# EAGLE design Group_08 (EAGLE 9.6.2)
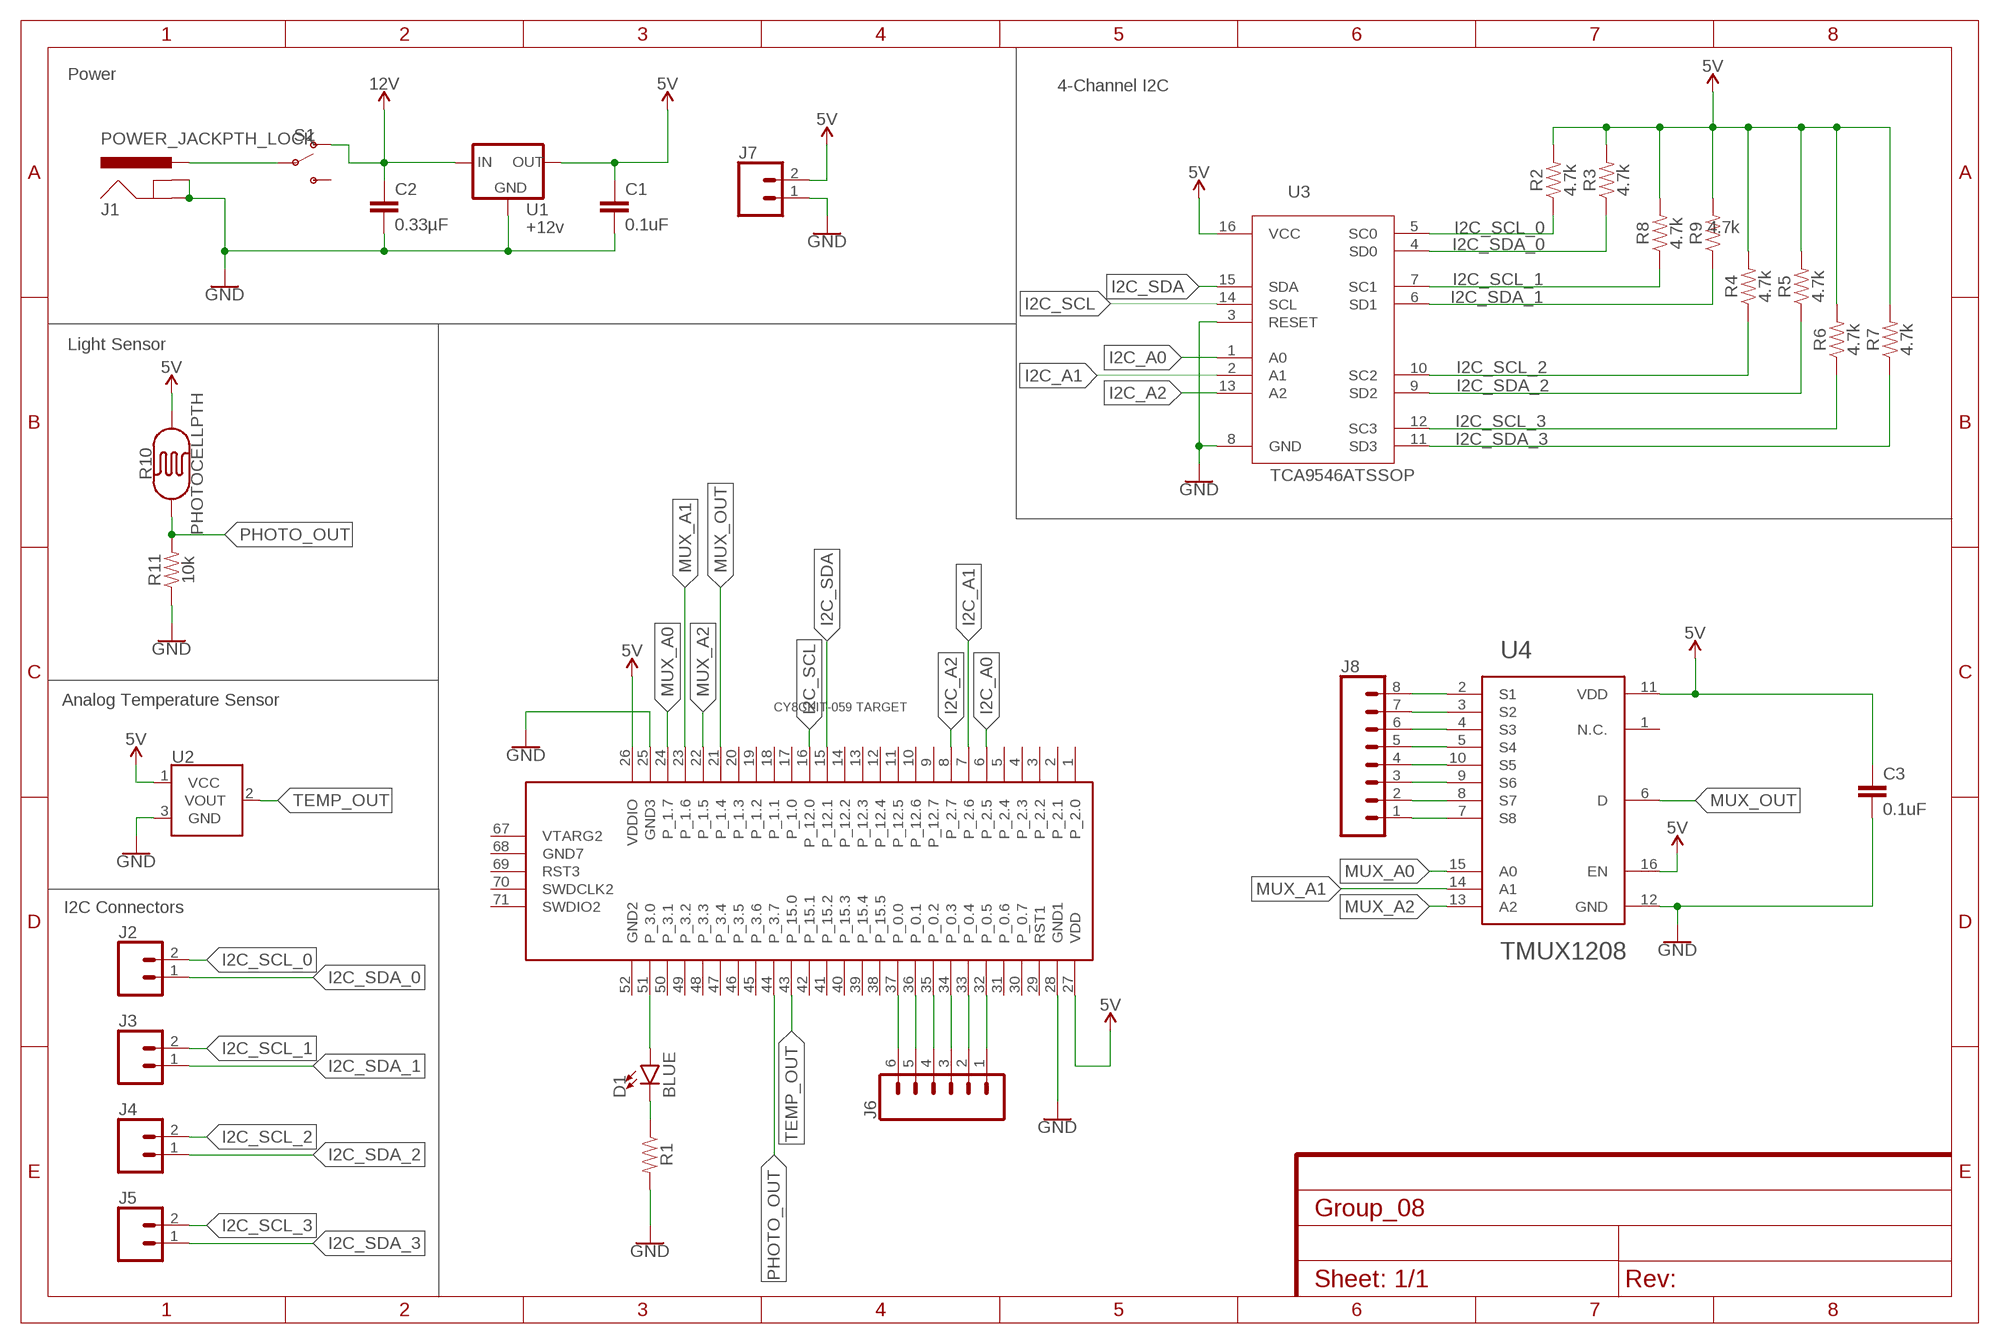
[diagram p0: schematic, sheet 1]

## Parts
C1  0.1uF  0.1UF-KIT-EZ-50V-20%  [CAP-PTH-SMALL-KIT]
C2  0.33µF  0.33UF/330NF-0805-50V-10%  [0805]
C3  0.1uF  0.1UF-KIT-EZ-50V-20%  [CAP-PTH-SMALL-KIT]
CY8CKIT059-TARGET  CY8CKIT-059_TARGET  [CY8CKIT-059_TARGET]
D1  BLUE  LED-BLUE1206  [LED-1206]
J1  POWER_JACKPTH_LOCK  [POWER_JACK_PTH_LOCK]
J2  CONN_02  [1X02]
J3  CONN_02  [1X02]
J4  CONN_02  [1X02]
J5  CONN_02  [1X02]
J6  CONN_06LOCK  [1X06_LOCK]
J7  CONN_02  [1X02]
J8  CONN_08LOCK  [1X08_LOCK]
R1  RESISTORAXIAL-0.3  [AXIAL-0.3]
R2  4.7k  4.7KOHM-0603-1/10W-1%  [0603]
R3  4.7k  4.7KOHM-0603-1/10W-1%  [0603]
R4  4.7k  4.7KOHM-0603-1/10W-1%  [0603]
R5  4.7k  4.7KOHM-0603-1/10W-1%  [0603]
R6  4.7k  4.7KOHM-0603-1/10W-1%  [0603]
R7  4.7k  4.7KOHM-0603-1/10W-1%  [0603]
R8  4.7k  4.7KOHM-0603-1/10W-1%  [0603]
R9  4.7k  4.7KOHM-0603-1/10W-1%  [0603]
R10  PHOTOCELLPTH  [PHOTOCELL]
R11  10k  10KOHM-0603-1/10W-1%  [0603]
S1  SWITCH-SPDT-PTH-11.6X4.0MM  [SWITCH_SPDT_PTH_11.6X4.0MM]
U1  +12v  V_REG_78XX7812  [TO-252]
U2  TMP36GT9  [TO-92]
U3  TCA9546ATSSOP  [TSSOP16]
U4  TMUX1208  [QFN16]

## Nets
5V: C1.1 C3.1 CY8CKIT059-TARGET.26(VDDIO) CY8CKIT059-TARGET.27(VDD) J7.2 R2.2 R3.2 R4.2 R5.2 R6.2 R7.2 R8.2 R9.2 R10.2 U1.2(OUT) U2.1(VCC) U3.16(VCC) U4.11(VDD) U4.16(EN)
12V: C2.1 S1.1(O) U1.1(IN)
GND: C1.2 C2.2 C3.2 CY8CKIT059-TARGET.25(GND3) CY8CKIT059-TARGET.28(GND1) J1.GND J1.GNDBREAK J7.1 R1.P$2 R11.1 U1.3(GND) U2.3(GND) U3.3(RESET) U3.8(GND) U4.12(GND)
I2C_A0: CY8CKIT059-TARGET.6(P_2.5) U3.1(A0)
I2C_A1: CY8CKIT059-TARGET.7(P_2.6) U3.2(A1)
I2C_A2: CY8CKIT059-TARGET.8(P_2.7) U3.13(A2)
I2C_SCL: CY8CKIT059-TARGET.16(P_12.0) U3.14(SCL)
I2C_SCL_0: J2.2 R2.1 U3.5(SC0)
I2C_SCL_1: J3.2 R8.1 U3.7(SC1)
I2C_SCL_2: J4.2 R4.1 U3.10(SC2)
I2C_SCL_3: J5.2 R6.1 U3.12(SC3)
I2C_SDA: CY8CKIT059-TARGET.15(P_12.1) U3.15(SDA)
I2C_SDA_0: J2.1 R3.1 U3.4(SD0)
I2C_SDA_1: J3.1 R9.1 U3.6(SD1)
I2C_SDA_2: J4.1 R5.1 U3.9(SD2)
I2C_SDA_3: J5.1 R7.1 U3.11(SD3)
MUX_A0: CY8CKIT059-TARGET.24(P_1.7) U4.15(A0)
MUX_A1: CY8CKIT059-TARGET.23(P_1.6) U4.14(A1)
MUX_A2: CY8CKIT059-TARGET.22(P_1.5) U4.13(A2)
MUX_OUT: CY8CKIT059-TARGET.21(P_1.4) U4.6(D)
N$2: J1.PWR S1.2(P)
N$10: J8.1 U4.7(S8)
N$11: J8.2 U4.8(S7)
N$12: J8.3 U4.9(S6)
N$13: J8.4 U4.10(S5)
N$14: J8.5 U4.5(S4)
N$16: J8.6 U4.4(S3)
N$17: J8.7 U4.3(S2)
N$18: J8.8 U4.2(S1)
N$19: CY8CKIT059-TARGET.37(P_0.0) J6.6
N$20: CY8CKIT059-TARGET.32(P_0.5) J6.1
N$21: CY8CKIT059-TARGET.33(P_0.4) J6.2
N$22: CY8CKIT059-TARGET.34(P_0.3) J6.3
N$23: CY8CKIT059-TARGET.35(P_0.2) J6.4
N$24: CY8CKIT059-TARGET.36(P_0.1) J6.5
N$25: D1.C R1.P$1
N$26: CY8CKIT059-TARGET.51(P_3.0) D1.A
PHOTO_OUT: CY8CKIT059-TARGET.44(P_3.7) R10.1 R11.2
TEMP_OUT: CY8CKIT059-TARGET.43(P_15.0) U2.2(VOUT)
Unconnected: CY8CKIT059-TARGET.1(P_2.0) CY8CKIT059-TARGET.2(P_2.1) CY8CKIT059-TARGET.3(P_2.2) CY8CKIT059-TARGET.4(P_2.3) CY8CKIT059-TARGET.5(P_2.4) CY8CKIT059-TARGET.9(P_12.7) CY8CKIT059-TARGET.10(P_12.6) CY8CKIT059-TARGET.11(P_12.5) CY8CKIT059-TARGET.12(P_12.4) CY8CKIT059-TARGET.13(P_12.3) CY8CKIT059-TARGET.14(P_12.2) CY8CKIT059-TARGET.17(P_1.0) CY8CKIT059-TARGET.18(P_1.1) CY8CKIT059-TARGET.19(P_1.2) CY8CKIT059-TARGET.20(P_1.3) CY8CKIT059-TARGET.29(RST1) CY8CKIT059-TARGET.30(P_0.7) CY8CKIT059-TARGET.31(P_0.6) CY8CKIT059-TARGET.38(P_15.5) CY8CKIT059-TARGET.39(P_15.4) CY8CKIT059-TARGET.40(P_15.3) CY8CKIT059-TARGET.41(P_15.2) CY8CKIT059-TARGET.42(P_15.1) CY8CKIT059-TARGET.45(P_3.6) CY8CKIT059-TARGET.46(P_3.5) CY8CKIT059-TARGET.47(P_3.4) CY8CKIT059-TARGET.48(P_3.3) CY8CKIT059-TARGET.49(P_3.2) CY8CKIT059-TARGET.50(P_3.1) CY8CKIT059-TARGET.52(GND2) CY8CKIT059-TARGET.67(VTARG2) CY8CKIT059-TARGET.68(GND7) CY8CKIT059-TARGET.69(RST3) CY8CKIT059-TARGET.70(SWDCLK2) CY8CKIT059-TARGET.71(SWDIO2) S1.3(S) U4.1(N.C.)

## Notes on the sheet
- Power
- 4-Channel I2C
- Light Sensor
- Analog Temperature Sensor
- I2C Connectors

## Library data of the parts
C1 C3 = SparkFun-Capacitors:0.1UF: 0.1µF ceramic capacitors A capacitor is a passive two-terminal electrical component used to store electrical energy temporarily in an electric field.; PROD_ID: CAP-08370
C2 = SparkFun-Capacitors:0.33UF/330NF: 0.33µF/330nF ceramic capacitors A capacitor is a passive two-terminal electrical component used to store electrical energy temporarily in an electric field.; PROD_ID: CAP-08469
CY8CKIT059-TARGET = CY8KIT-059:CY8CKIT-059_TARGET: CY8CKIT-059 Target This device exposes the pins of the target section of the CY8CKIT-059, including the programming section, that must be connected to the KitProg in order to program the target micro-controller.
D1 = SparkFun-LED:LED-BLUE: Blue SMD LED Used in manufacturing of various products at SparkFun Packages: 0603 - SMD 0603 package [Product Link] <http://www.digikey.com/product-detail/en/SMLE12BC7TT86/511-1589-2-ND/1641808> 1206 - SMD1206 package [Product Link] <http://www.digikey.com/product-detail/en/lite-on-inc/LTST-C150TBKT/160-1643-1-ND/573584> SparkFun Products: ESP8266 Thing-Dev Board <https://www.sparkfun.com/products/13711> RedBoard <https://www.sparkfun.com/products/12757>; PROD_ID: DIO-09911
J1 = SparkFun-Connectors:POWER_JACK: Power Jack Connector This is the standard 5.5mm barrel jack for power. The PTH is the most common, proven, reliable, footprint. The Slot footprint only works if the mill layer is transmitted to the PCB fab house so be warned. Here are the connectors we sell at SparkFun: DC Barrel Power Jack/Connector <https://www.sparkfun.com/products/119> (PRT-00119) DC Barrel Power Jack/Connector (SMD) <https://www.sparkfun.com/products/12748> (PRT-12748) DC Barrel Jack Adapter - Breadboard Compatible <https://www.sparkfun.com/products/10811> (PRT-10811) It is used on this SparkFun product (and many, many others): SparkFun RedBoard - Programmed with Arduino <https://www.sparkfun.com/products/12757> (DEV-12757) Also, if you need a mating power supply or connector, please check these out: Wall Adapter Power Supply - 9VDC 650mA <https://www.sparkfun.com/products/298> (TOL-00298) DC Barrel Jack Adapter - Male <https://www.sparkfun.com/products/10287> (PRT-10287); PROD_ID: CONN-08197; SF_ID: PRT-00119
J2-J5 J7 = SparkFun-Connectors:CONN_02: Multi connection point. Often used as Generic Header-pin footprint for 0.1 inch spaced/style header connections On any of the 0.1 inch spaced packages, you can populate with these: Break Away Headers - Straight <https://www.sparkfun.com/products/116> (PRT-00116) Break Away Male Headers - Right Angle <https://www.sparkfun.com/products/553> (PRT-00553) Female Headers <https://www.sparkfun.com/products/115> (PRT-00115) Break Away Headers - Machine Pin <https://www.sparkfun.com/products/117> (PRT-00117) Break Away Female Headers - Swiss Machine Pin <https://www.sparkfun.com/products/743> (PRT-00743) For SCREWTERMINALS and SPRING TERMINALS visit here: Screw Terimnals on SparkFun.com <https://www.sparkfun.com/search/results?term=Screw+Terminals> (5mm/3.5mm/2.54mm spacing) This device is also useful as a general connection point to wire up your design to another part of your project. Our various solder wires solder well into these plated through hole pads. Hook-Up Wire - Assortment (Stranded, 22 AWG) <https://www.sparkfun.com/products/11375> (PRT-11375) Hook-Up Wire - Assortment (Solid Core, 22 AWG) <https://www.sparkfun.com/products/11367> (PRT-11367) View the entire wire category on our website here <https://www.sparkfun.com/categories/141> Special notes: Molex polarized connector foot print use with: PRT-08233 with associated crimp pins and housings. 2.54_SCREWTERM for use with PRT-10571. 3.5mm Screw Terminal footprints for PRT-08084 5mm Screw Terminal footprints for use with PRT-08432
J6 = SparkFun-Connectors:CONN_06: Multi connection point. Often used as Generic Header-pin footprint for 0.1 inch spaced/style header connections On any of the 0.1 inch spaced packages, you can populate with these: Break Away Headers - Straight <https://www.sparkfun.com/products/116> (PRT-00116) Break Away Male Headers - Right Angle <https://www.sparkfun.com/products/553> (PRT-00553) Female Headers <https://www.sparkfun.com/products/115> (PRT-00115) Break Away Headers - Machine Pin <https://www.sparkfun.com/products/117> (PRT-00117) Break Away Female Headers - Swiss Machine Pin <https://www.sparkfun.com/products/743> (PRT-00743) Arduino Stackable Header - 6 Pin <https://www.sparkfun.com/products/9280> (PRT-09280) For SCREWTERMINALS and SPRING TERMINALS visit here: Screw Terimnals on SparkFun.com <https://www.sparkfun.com/search/results?term=Screw+Terminals> (5mm/3.5mm/2.54mm spacing) This device is also useful as a general connection point to wire up your design to another part of your project. Our various solder wires solder well into these plated through hole pads. Hook-Up Wire - Assortment (Stranded, 22 AWG) <https://www.sparkfun.com/products/11375> (PRT-11375) Hook-Up Wire - Assortment (Solid Core, 22 AWG) <https://www.sparkfun.com/products/11367> (PRT-11367) View the entire wire category on our website here <https://www.sparkfun.com/categories/141>
J8 = SparkFun-Connectors:CONN_08: Multi connection point. Often used as Generic Header-pin footprint for 0.1 inch spaced/style header connections On any of the 0.1 inch spaced packages, you can populate with these: Break Away Headers - Straight <https://www.sparkfun.com/products/116> (PRT-00116) Break Away Male Headers - Right Angle <https://www.sparkfun.com/products/553> (PRT-00553) Female Headers <https://www.sparkfun.com/products/115> (PRT-00115) Break Away Headers - Machine Pin <https://www.sparkfun.com/products/117> (PRT-00117) Break Away Female Headers - Swiss Machine Pin <https://www.sparkfun.com/products/743> (PRT-00743) Arduino Stackable Header - 8 Pin <https://www.sparkfun.com/products/9279> (PRT-09279) For SCREWTERMINALS and SPRING TERMINALS visit here: Screw Terimnals on SparkFun.com <https://www.sparkfun.com/search/results?term=Screw+Terminals> (5mm/3.5mm/2.54mm spacing) This device is also useful as a general connection point to wire up your design to another part of your project. Our various solder wires solder well into these plated through hole pads. Hook-Up Wire - Assortment (Stranded, 22 AWG) <https://www.sparkfun.com/products/11375> (PRT-11375) Hook-Up Wire - Assortment (Solid Core, 22 AWG) <https://www.sparkfun.com/products/11367> (PRT-11367) View the entire wire category on our website here <https://www.sparkfun.com/categories/141> Special notes: Molex polarized connector foot print use with SKU : PRT-08231 with associated crimp pins and housings. 1MM SMD Version SKU: PRT-10208 NOTES ON THE VARIANTS LOCK and LOCK_LONGPADS... This footprint was designed to help hold the alignment of a through-hole component (i.e. 6-pin header) while soldering it into place. You may notice that each hole has been shifted either up or down by 0.005 of an inch from it's more standard position (which is a perfectly straight line). This slight alteration caused the pins (the squares in the middle) to touch the edges of the holes. Because they are alternating, it causes a "brace" to hold the component in place. 0.005 has proven to be the perfect amount of "off-center" position when using our standard breakaway headers. Although looks a little odd when you look at the bare footprint, once you have a header in there, the alteration is very hard to notice. Also,if you push a header all the way into place, it is covered up entirely on the bottom side.
R1 = SparkFun-Resistors:RESISTOR: Generic Resistor Package
R2-R9 = SparkFun-Resistors:4.7KOHM: 4.7kΩ resistor A resistor is a passive two-terminal electrical component that implements electrical resistance as a circuit element. Resistors act to reduce current flow, and, at the same time, act to lower voltage levels within circuits. - Wikipedia; PROD_ID: RES-07857
R10 = SparkFun-Sensors:PHOTOCELL: Photocell (Photodetector, Photo Resistor, CdS) This is a very small light sensor. A photocell changes (also called a photodetector, photo resistor, CdS or photoconductive cell) resistance depending on the amount of light it is exposed to. These little sensors make great ambient light triggers (when light in the room turns on, do something). Datasheet <http://cdn.sparkfun.com/datasheets/Sensors/LightImaging/SEN-09088.pdf> SparkFun Products Mini Photocell <https://www.sparkfun.com/products/9088> (SEN-09088); PROD_ID: COMP-09129; SF_ID: SEN-09088
R11 = SparkFun-Resistors:10KOHM: 10kΩ resistor A resistor is a passive two-terminal electrical component that implements electrical resistance as a circuit element. Resistors act to reduce current flow, and, at the same time, act to lower voltage levels within circuits. - Wikipedia; PROD_ID: RES-00824
S1 = SparkFun-Switches:SWITCH-SPDT: Single Pole, Double Throw (SPDT) Switch Single-pole, double-throw (SPDT) switch. Variant Overview SMD-AYZ0202 Surface Mount DPDT Switch <https://www.sparkfun.com/products/597> (COM-00597) Used on e.g. LilyPad Arduino USB - ATmega32U4 Board <https://www.sparkfun.com/products/12049> PTH-11.6X4.0MM SPDT Mini Power Switch <https://www.sparkfun.com/products/102> (COM-00102) Used on e.g. SparkFun Simon Says - Through-Hole Soldering Kit <https://www.sparkfun.com/products/10547> (KIT-10547) PTH-11.6X4.0MM-KIT KIT version of SPDT Mini Power Switch - Simplifies soldering by removing tStop of switch pins - only one side can be soldered. PTH-11.6X4.0MM-LOCK LOCK version of SPDT Mini Power Switch - Offset pins hold switch in place for easier soldering. SMD-RIGHT-ANGLE Surface Mount Right Angle Switch <https://www.sparkfun.com/products/10860> (COM-10860) Used on e.g. SparkFun ESP8266 Thing <https://www.sparkfun.com/products/13231>; PROD_ID: SWCH-08261; SF_SKU: COM-00102
U1 = SparkFun-IC-Power:V_REG_78XX: Voltage Regulator Standard 78xx regulator. IGO (Input Ground Output). Spark Fun Electronics SKU : COM-00107; PROD_ID: VREG-12370
U2 = SparkFun-Sensors:TMP36: TMP36 Precision Analog °C Temperature Sensor The TMP36 is a low voltage, precision centigrade temperature sensor. It provides a voltage output that is linearly proportional to the Celsius temperature. It also doesn’t require any external calibration to provide typical accuracies of ±1°C at +25°C and ±2°C over the −40°C to +125°C temperature range. We like it because it’s so easy to use: Just give the device a ground and 2.7 to 5.5 VDC and read the voltage on the Vout pin. The output voltage can be converted to temperature easily using the scale factor of 10 mV/°C. Datasheet <http://cdn.sparkfun.com/datasheets/Sensors/Temp/TMP35_36_37.pdf> SparkFun Products Temperature Sensor - TMP36 <https://www.sparkfun.com/products/10988> (SEN-10988) SparkFun Danger Shield <https://www.sparkfun.com/products/11649> (DEV-11649); PROD_ID: IC-09880; SF_ID: SEN-10988
U3 = Group_08_Library:TCA9546A: The TCA9546A is a quad bidirectional translating switch controlled via the I2C bus. The SCL/SDA upstream pair fans out to four downstream pairs, or channels. Any individual SCn/SDn channel or combination of channels can be selected, determined by the contents of the programmable control register. An active-low reset (RESET) input allows the TCA9546A to recover from a situation in which one of the downstream I 2C buses is stuck in a low state. Pulling RESET low resets the I 2C state machine and causes all the channels to be deselected, as does the internal power-on reset function. The pass gates of the switches are constructed such that the VCC pin can be used to limit the maximum high voltage, which will be passed by the TCA9546A. This allows the use of different bus voltages on each pair, so that 1.8-V, 2.5-V, or 3.3-V parts can communicate with 5-V parts without any additional protection. External pull-up resistors pull the bus up to the desired voltage level for each channel. All I/O pins are 5.5-V tolerant. Features 1-of-4 Bidirectional translating switches I2C Bus and SMBus compatible Active-low reset input Three address pins, allowing up to eight TCA9546A devices on the I 2C bus Channel selection via I 2C Bus, in any combination Power-up with all switch channels deselected Low RON switches Allows voltage-level translation between 1.8-V, 2.5-V, 3.3-V, and 5-V buses No glitch on power-up Supports hot insertion Low standby current Operating power-supply voltage range of 1.65 V to 5.5 V 5.5 V Tolerant inputs 0 to 400-kHz Clock frequency Latch-up performance exceeds 100 mA Per JESD 78 ESD Protection exceeds JESD 22 4000-V Human-body model (A114-A) 1500-V Charged-device model (C101)
U4 = Group_08_Library:TMUX1208: The TMUX1208 is a general purpose complementary metal-oxide semiconductor (CMOS) multiplexer (MUX). The TMUX1208 offers 8:1 singleended channels. Wide operating supply of 1.08 V to 5.5 V allows for use in a broad array of applications from personal electronics to building automation applications. The device supports bidirectional analog and digital signals on the source (Sx) and drain (D) pins ranging from GND to VDD

## Board
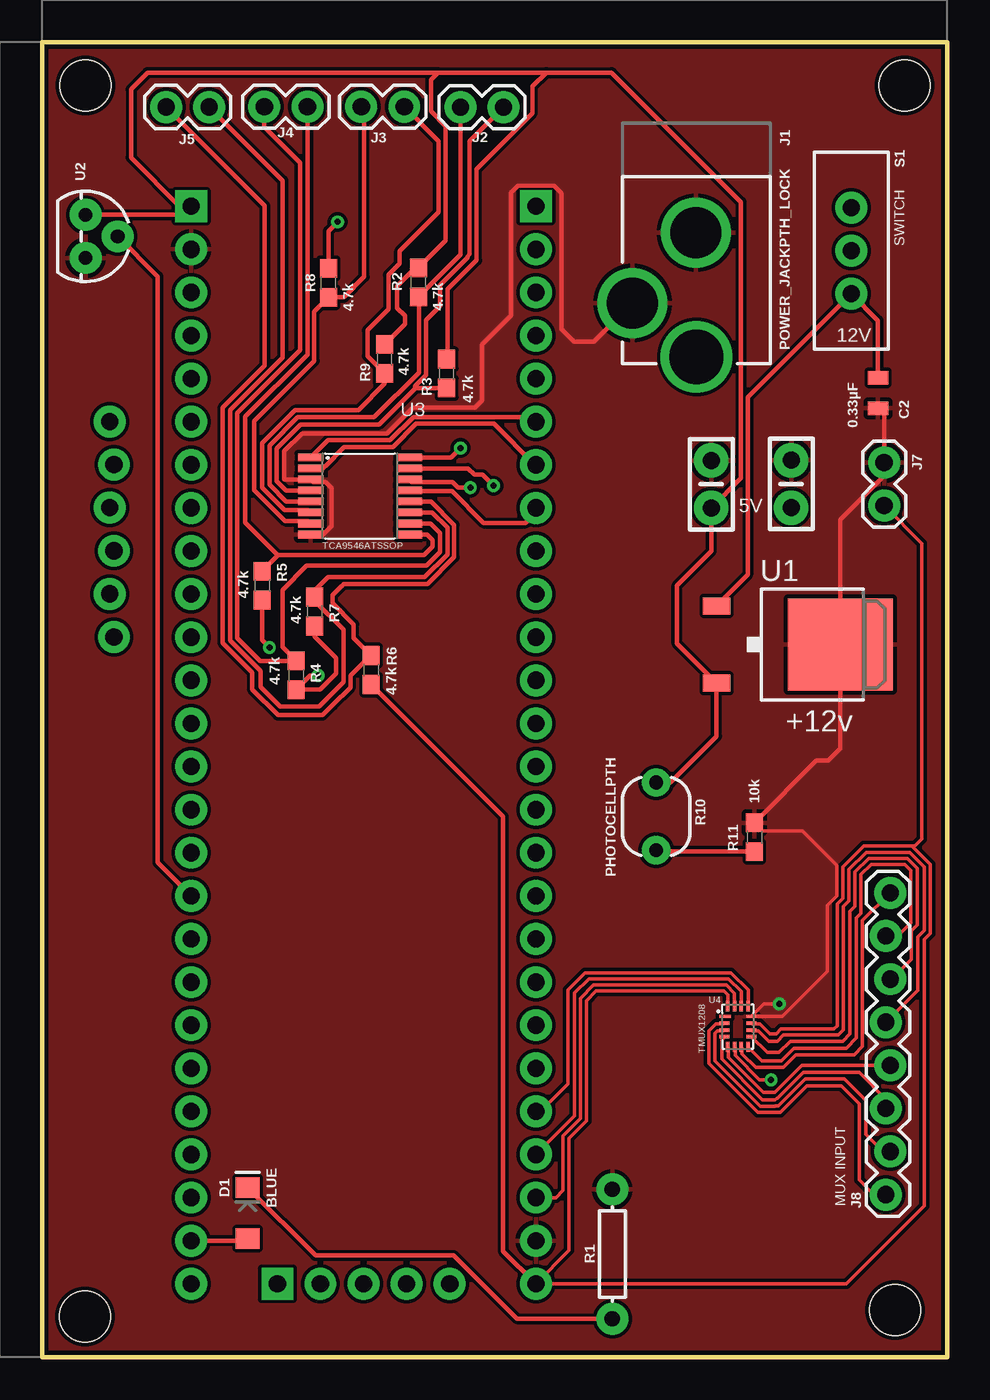
[diagram p1: board, top side]
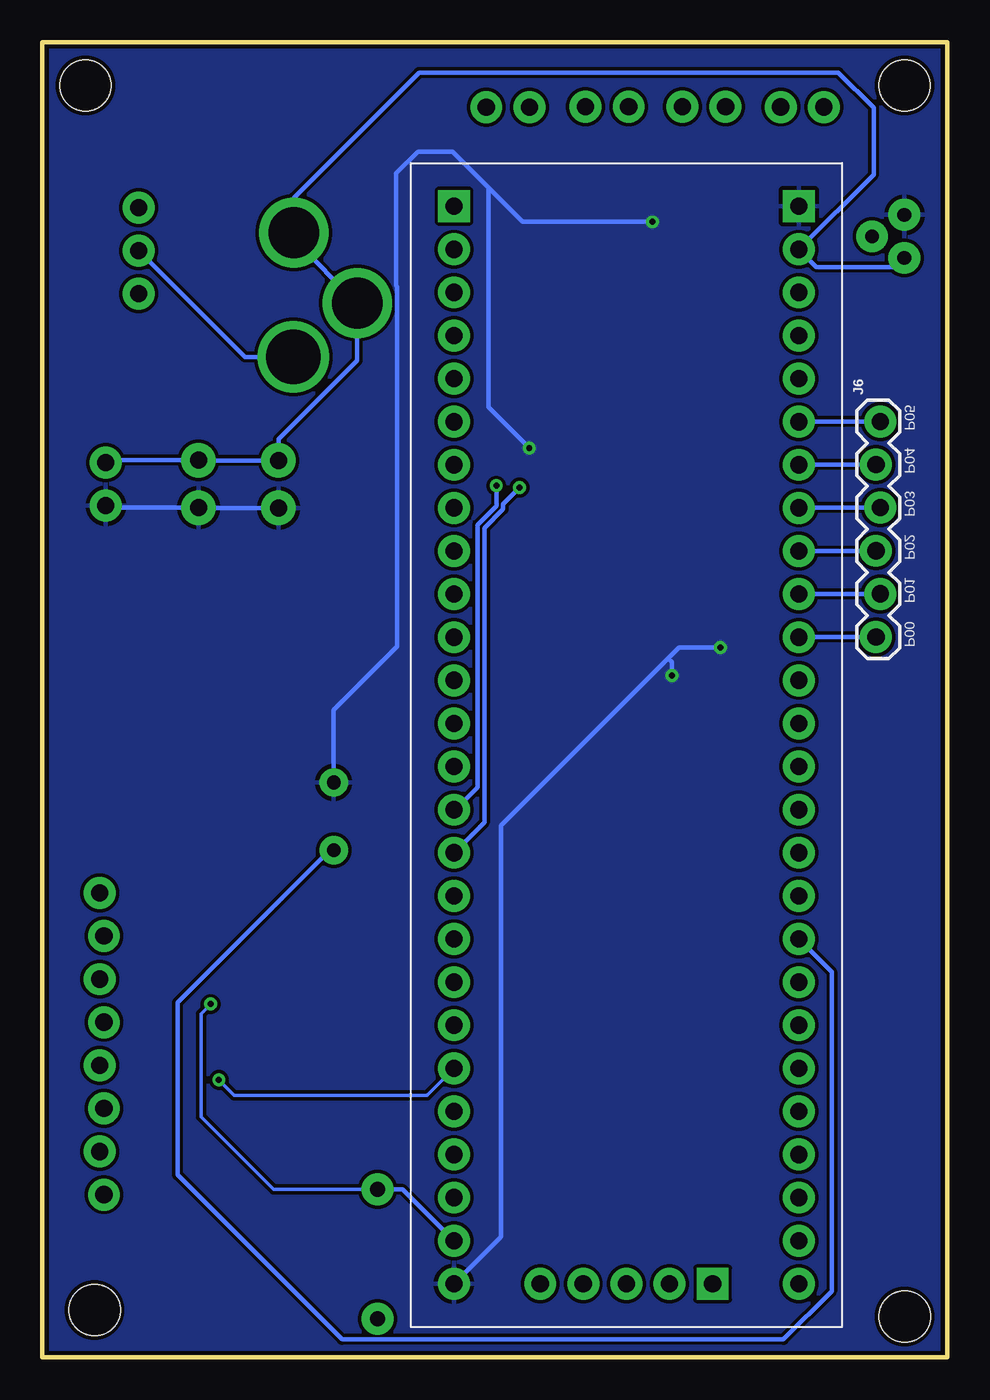
[diagram p2: board, bottom side, seen from below]

Size 53.34 x 77.47 mm. Coordinates in mm from the lower left corner, seen from the top.
Outline: 0,77.47 53.34,77.47 53.34,0 0,0 0,77.47
Copper layers (1*16): Top 0.035mm / dielectric 1.5mm / Bottom 0.035mm
Design rules "Group_08": minimum track width 6mil, minimum drill 8mil, track to track 6mil, track to pad 6mil, pad to pad 6mil, via to via 6mil, smd to smd 6mil, copper to edge 10mil, drill to drill 6mil, minimum pad ring 10mil, minimum via ring 8mil, stop-mask expansion 8mil, vias tented up to drill 0mil, thermal gap 10mil
Holes 3 mm at 2.54,74.93 50.8,74.93 2.52,2.4 50.26,2.77

### Footprints (pad centres in the part's own frame; a part is rotated, then mirrored left to right if it is on the bottom)
CAP-PTH-SMALL-KIT = drill 1.016 pad 2.032: 1 -1.397,0; 2 1.397,0
0805 = smd 0.8 x 1.2: 1 -0.9,0; 2 0.9,0
CY8CKIT-059_TARGET = drill 1.016 pad 1.876 square: 1 30.48,8.89; 27 30.48,-11.43; 71 -33.02,-6.35 | drill 1.016 pad 1.876: 2 27.94,8.89; 3 25.4,8.89; 4 22.86,8.89; 5 20.32,8.89; 6 17.78,8.89; 7 15.24,8.89; 8 12.7,8.89; 9 10.16,8.89; 10 7.62,8.89; 11 5.08,8.89; 12 2.54,8.89; 13 0,8.89; 14 -2.54,8.89; 15 -5.08,8.89; 16 -7.62,8.89; 17 -10.16,8.89; 18 -12.7,8.89; 19 -15.24,8.89; 20 -17.78,8.89; 21 -20.32,8.89; 22 -22.86,8.89; 23 -25.4,8.89; 24 -27.94,8.89; 25 -30.48,8.89; 26 -33.02,8.89; 28 27.94,-11.43; 29 25.4,-11.43; 30 22.86,-11.43; 31 20.32,-11.43; 32 17.78,-11.43; 33 15.24,-11.43; 34 12.7,-11.43; 35 10.16,-11.43; 36 7.62,-11.43; 37 5.08,-11.43; 38 2.54,-11.43; 39 0,-11.43; 40 -2.54,-11.43; 41 -5.08,-11.43; 42 -7.62,-11.43; 43 -10.16,-11.43; 44 -12.7,-11.43; 45 -15.24,-11.43; 46 -17.78,-11.43; 47 -20.32,-11.43; 48 -22.86,-11.43; 49 -25.4,-11.43; 50 -27.94,-11.43; 51 -30.48,-11.43; 52 -33.02,-11.43; 67 -33.02,3.81; 68 -33.02,1.27; 69 -33.02,-1.27; 70 -33.02,-3.81
LED-1206 = smd 1.2 x 1.4: A -1.5,0; C 1.5,0
POWER_JACK_PTH_LOCK = drill 2.997 pad 4.115: GND 0.025,6.557; GNDBREAK 3.762,10.7 | drill 3.2 pad 4.115: PWR 0,13.878
1X02 = drill 1.016 pad 1.88: 1 0,0; 2 2.54,0
1X06_LOCK = drill 1.016 pad 1.88: 1 0,0; 2 2.54,-0.254; 3 5.08,0; 4 7.62,-0.254; 5 10.16,0; 6 12.7,-0.254
1X08_LOCK = drill 1.016 pad 1.88: 1 0,0.127; 2 2.54,-0.127; 3 5.08,0.127; 4 7.62,-0.127; 5 10.16,0.127; 6 12.7,-0.127; 7 15.24,0.127; 8 17.78,-0.127
AXIAL-0.3 = drill 0.9 pad 1.88: P$1 -3.81,0; P$2 3.81,0
0603 = smd 1.1 x 1: 1 -0.85,0; 2 0.85,0
PHOTOCELL = drill 0.8 pad 1.676: 1 -2,0; 2 2,0
SWITCH_SPDT_PTH_11.6X4.0MM = drill 1.016 pad 1.88: 1 0,2.54; 2 0,0; 3 0,-2.54
TO-252 = smd 1 x 1.6: 1 -2.28,-4.8; 2 2.28,-4.8 | smd 5.4 x 6.2: 3 0,2.5
TO-92 = drill 0.813 pad 1.88: 1 -1.27,0; 2 0,1.905; 3 1.27,0
TSSOP16 = smd 1.5 x 0.45: 1 -2.9,2.275; 2 -2.9,1.625; 3 -2.9,0.975; 4 -2.9,0.325; 5 -2.9,-0.325; 6 -2.9,-0.975; 7 -2.9,-1.625; 8 -2.9,-2.275; 9 2.9,-2.275; 10 2.9,-1.625; 11 2.9,-0.975; 12 2.9,-0.325; 13 2.9,0.325; 14 2.9,0.975; 15 2.9,1.625; 16 2.9,2.275
QFN16 = smd 0.7 x 0.2: 1 -0.75,0.6 | smd 0.6 x 0.2: 2 -0.8,0.2; 3 -0.8,-0.2; 4 -0.8,-0.6; 9 0.8,-0.6; 10 0.8,-0.2; 11 0.8,0.2; 12 0.8,0.6 | smd 0.2 x 0.6: 5 -0.6,-1.2; 6 -0.2,-1.2; 7 0.2,-1.2; 8 0.6,-1.2; 13 0.6,1.2; 14 0.2,1.2; 15 -0.2,1.2; 16 -0.6,1.2

### Placement (x,y rotation side)
C1  39.42,51.43 90 top
C2  49.25,56.81 270 top
C3  44.14,51.45 90 top
CY8CKIT059-TARGET  20.19,37.34 90 bottom
D1  12.09,8.49 90 top
J1  38.54,72.82 180 top
J2  27.18,73.66 180 top
J3  21.33,73.69 180 top
J4  15.62,73.68 180 top
J5  9.83,73.66 180 top
J6  3.96,55.13 270 bottom
J7  49.61,52.71 270 top
J8  49.84,27.35 270 top
R1  33.59,6.07 90 top
R2  22.16,63.33 90 top
R3  23.82,57.96 90 top
R4  14.96,40.17 270 top
R5  12.95,45.46 270 top
R6  19.37,40.49 270 top
R7  16.05,43.93 270 top
R8  16.86,63.3 90 top
R9  20.17,58.82 90 top
R10  36.17,31.86 90 top
R11  41.96,30.64 270 top
S1  47.67,65.2 180 top
U1  44.53,41.99 270 top
U2  2.54,66.04 270 top
U3  18.71,50.74 0 top
U4  40.99,19.48 0 top

### Tracks (layer width: path | path; a pad name or v marks a point on that pad's centre or on a via)
5V  (via drill 0.35)
  Top 0.203: CY8CKIT059-TARGET.26 31.04,6.28 31.04,12.89 32.08,13.92 32.08,21 32.64,21.57 40.15,21.57 40.39,21.33 U4.16 | U4.11 41.83,19.63 42.3,19.63 42.88,19.05 43.25,19.05 43.53,19.33 46.65,19.33 46.84,19.53 46.84,26.71 47.18,27.04 47.18,28.88 48.41,30.11 51.26,30.11 | 51.26,30.11 51.28,30.08 52.34,29.02 52.34,24.98 51.98,24.62 51.98,8.91 47.39,4.32 29.21,4.32 | J7.2 51.83,47.95 51.83,30.53 51.41,30.11 51.26,30.11
  Top 0.254: U2.1 8.26,67.31 8.72,67.77 | 8.72,67.77 CY8CKIT059-TARGET.27 | 23.31,75.69 22.9,75.28 22.9,73.41 23.76,72.54 23.76,65.79 R2.2 21.99,64.18 20.91,63.1 20.91,61.81 21.36,61.36 21.36,60.86 R9.2 | 23.31,75.69 29.7,75.69 | 29.7,75.69 33.54,75.69 41.17,68.06 41.17,51.78 C1.1 39.42,47.49 37.41,45.48 37.41,42.04 U1.2 39.73,36.58 37.02,33.86 R10.2 | 23.31,75.69 6.2,75.69 5.22,74.71 5.22,70.68 8.13,67.77 8.72,67.77 | R5.2 12.95,42.25 v13.38,41.82 | v16.24,40.16 15.79,40.16 R4.2 16.35,39.33 17.31,40.28 17.31,41.2 16.05,42.46 R7.2 | U3.16 24.09,53.02 v24.65,53.57 | R8.2 16.86,66.36 v17.4,66.9 | 29.7,75.69 28.88,74.88 28.88,73.3 25.59,70.01 25.59,64.63 23.88,62.92 23.88,58.87 R3.2 | R6.2 27.16,31.85 27.16,6.25 CY8CKIT059-TARGET.26 29.21,4.32
  Bottom 0.254: v13.38,41.82 15.82,41.82 16.46,41.17 | CY8CKIT059-TARGET.26 26.31,7.09 26.31,31.33 16.46,41.17 | v16.24,40.16 16.24,40.95 16.46,41.17 | v24.65,53.57 27.06,55.99 27.06,68.92 | R10.2 36.17,38.14 32.45,41.86 32.45,63.08 32.49,63.12 32.49,69.75 31.2,71.04 29.18,71.04 27.06,68.92 | v17.4,66.9 25.03,66.9 27.06,68.92 | C1.1 44.07,50.04 44.11,50.08 C3.1 49.49,50.06 J7.2
  pour Bottom (isolate 0.203): 0,0 53.34,0 53.34,77.47 0,77.47
12V
  Top 0.254: C2.1 49.25,61.08 S1.1 41.57,56.56 41.57,46.11 U1.1
GND  (via drill 0.35)
  Top 0.203: R11.1 42.44,31.01 44.78,31.01 46.82,28.96 46.82,27.19 46.26,26.63 46.26,22.71 43.62,20.08 U4.12 42.52,20.8 v43.42,20.8
  Top 0.254: U3.8 16.54,48.47 17.05,48.98 17.05,51.21 16.68,51.57 15.96,51.57 U3.3 14.27,51.72 14.25,51.74 14.25,53.39 15.29,54.43 20.32,54.43 21.84,55.96 25.49,55.96 25.91,56.38 25.91,59.67 27.62,61.38 27.62,68.63 28.03,69.03 30.14,69.03 30.59,68.58 30.59,60.57 31.34,59.83 32.5,59.83 J1.GNDBREAK | R11.1 45.62,35.15 46.32,35.15 47.03,35.87 U1.3 47.03,49.36 49.61,51.93 J7.1 49.61,55.55 C2.2
  Bottom 0.203: v43.42,20.8 44,20.23 44,14.16 39.72,9.88 33.35,9.88
  Bottom 0.254: CY8CKIT059-TARGET.25 32.11,9.88 33.35,9.88 R1.P$2 | 3.08,64.23 7.72,64.23 CY8CKIT059-TARGET.28 4.35,69.69 4.35,73.63 6.42,75.69 31.16,75.69 38.52,68.33 J1.GND 38.52,65.85 J1.GNDBREAK 34.78,58.72 39.42,54.09 C1.2 44.12,52.83 C3.2 49.47,52.85 J7.1 | U2.3 3.08,64.23 | 3.08,64.23
  pour Top (isolate 0.203): 0,0 53.34,0 53.34,77.47 0,77.47
I2C_A0
  Top 0.254: U3.1 16.82,54.03 20.49,54.03 21.86,55.4 28.8,55.4 CY8CKIT059-TARGET.6
I2C_A1
  Top 0.254: U3.2 16.51,52.37 16.66,52.52 16.68,52.52 17.79,53.62 20.66,53.62 22.03,54.99 26.62,54.99 29.04,52.58 CY8CKIT059-TARGET.7
I2C_A2
  Top 0.254: U3.13 21.66,51.02 24.13,51.02 26,49.16 28.48,49.16 29.08,49.76 CY8CKIT059-TARGET.8
I2C_SCL  (via drill 0.35)
  Top 0.254: U3.14 21.76,51.57 24.16,51.57 24.49,51.24 v25.22,51.24
  Bottom 0.254: v25.22,51.24 26.18,50.28 26.18,49.97 27.29,48.87 27.29,31.51 CY8CKIT059-TARGET.16
I2C_SCL_0
  Top 0.254: U3.5 14.37,50.42 13.38,51.41 13.38,53.72 15.05,55.38 19.56,55.38 22.2,58.02 22.2,62.45 R2.1 24.64,64.97 J2.2
I2C_SCL_1
  Top 0.254: U3.7 15.67,49.27 14.3,49.27 12.47,51.1 12.47,55.15 16.02,58.7 16.02,61.61 R8.1 17.77,62.45 18.97,63.65 18.97,73.51 J3.2
I2C_SCL_2
  Top 0.254: U3.10 22.87,49.12 23.42,48.57 23.42,47.43 22.64,46.65 15.58,46.65 14.14,45.21 14.14,41.84 R4.1 12.84,41.02 11.48,42.38 11.48,55.64 15.19,59.35 15.19,70.39 13.08,72.5 J4.2
I2C_SCL_3
  Top 0.254: J5.2 13.1,67.85 13.1,58.41 10.63,55.94 10.63,42.08 12.37,40.34 12.37,39.34 13.89,37.82 16.51,37.82 17.11,38.42 18.15,39.46 18.15,40.16 19.32,41.34 R6.1 18.35,42.36 18.35,43.18 17.1,44.43 17.1,44.91 17.63,45.45 17.66,45.45 17.76,45.55 22.69,45.55 24.27,47.13 24.27,49.04 22.89,50.42 U3.12
I2C_SDA  (via drill 0.35)
  Top 0.254: U3.15 25.08,52.37 25.46,51.99 25.95,51.99 v26.59,51.35
  Bottom 0.254: v26.59,51.35 26.59,50.14 27.69,49.03 27.69,33.56 29,32.26 CY8CKIT059-TARGET.15
I2C_SDA_0
  Top 0.254: U3.4 14.35,51.07 13.79,51.62 13.79,53.54 15.21,54.95 19.84,54.95 21.97,57.08 21.97,57.11 | R3.1 21.97,57.11 | 21.97,57.11 21.97,57.22 22.6,57.85 22.6,61.12 23.43,61.94 23.43,63.18 25.05,64.8 25.05,64.86 25.18,65 25.18,71.66 J2.1
I2C_SDA_1
  Top 0.254: U3.6 15.67,49.91 14.27,49.91 12.95,51.23 12.95,53.87 14.88,55.8 18.62,55.8 20.17,57.35 R9.1 19.15,58.99 19.15,60.51 20.39,61.75 20.39,63.77 21.05,64.44 21.05,65.17 23.36,67.47 23.36,71.66 J3.1
I2C_SDA_2
  Top 0.254: R5.1 13.9,47.27 | U3.9 22.66,48.47 22.99,48.14 22.99,47.77 22.49,47.27 13.9,47.27 | J4.1 15.62,59.08 11.96,55.42 11.96,49.16 13.85,47.27 13.9,47.27
I2C_SDA_3
  Top 0.254: U3.11 22.97,49.77 23.86,48.87 23.86,47.3 22.52,45.96 16.84,45.96 16.05,45.17 R7.1 16.05,44.56 17.74,42.87 17.74,39.77 16.31,38.34 14.01,38.34 12.85,39.5 12.85,40.43 11.07,42.22 11.07,55.8 14.16,58.9 14.16,69.33 J5.1
MUX_A0
  Top 0.203: CY8CKIT059-TARGET.24 30.25,9.4 30.69,9.83 30.69,13.04 31.72,14.07 31.72,21.15 32.49,21.92 40.3,21.92 40.79,21.43 U4.15
MUX_A1
  Top 0.203: CY8CKIT059-TARGET.23 31.36,14.22 31.36,21.45 32.21,22.3 40.43,22.3 41.19,21.54 U4.14
MUX_A2
  Top 0.203: CY8CKIT059-TARGET.22 29.34,14.48 30.96,16.1 30.96,21.65 31.97,22.65 40.58,22.65 41.59,21.63 U4.13
MUX_OUT  (via drill 0.35)
  Top 0.203: U4.6 40.83,18.23 40.83,17.77 42.27,16.34 v42.94,16.34
  Bottom 0.203: v42.94,16.34 42.03,15.43 30.67,15.43 CY8CKIT059-TARGET.21
N$2
  Bottom 0.254: J1.PWR 41.41,58.94 S1.2
N$10
  Top 0.203: U4.7 41.23,18.23 41.23,17.87 42.04,17.07 43.66,17.07 44.41,17.82 47.84,17.82 48.34,18.31 48.34,25.72 J8.1
N$11
  Top 0.203: U4.8 42.41,17.46 43.55,17.46 44.28,18.19 47.37,18.19 47.98,18.81 47.98,25.87 48.25,26.14 48.25,28.44 48.85,29.04 50.81,29.04 51.19,28.66 51.19,25.59 50.41,24.81 J8.2
N$12
  Top 0.203: U4.9 42.72,17.95 43.41,17.95 44.08,18.62 47.17,18.62 47.59,19.04 47.59,26.27 47.89,26.57 47.89,28.58 48.7,29.4 50.96,29.4 51.58,28.78 51.58,25.47 51.22,25.11 51.22,23.43 50.06,22.27 J8.3
N$13
  Top 0.203: U4.10 41.83,19.23 42.19,19.23 42.81,18.61 43.32,18.61 43.68,18.97 46.9,18.97 47.2,19.27 47.2,22.61 | J8.4 51.59,21.61 51.59,24.76 51.98,25.15 51.98,28.89 51.11,29.75 48.56,29.75 47.53,28.73 47.53,26.89 47.2,26.56 47.2,22.61 | 47.2,22.61
N$14
  Top 0.203: U4.5 40.43,18.23 40.43,17.67 42.49,15.61 43.18,15.61 44.76,17.19 J8.5
N$16
  Top 0.203: U4.4 40.19,18.84 40.03,18.68 40.03,17.56 42.44,15.16 43.18,15.16 43.28,15.25 43.33,15.25 44.84,16.76 48.14,16.76 49.71,15.19 J8.6
N$17
  Top 0.203: U4.3 40.15,19.23 39.78,19.23 39.63,19.08 39.63,17.46 42.32,14.78 43.18,14.78 43.21,14.8 43.38,14.8 44.97,16.39 47.26,16.39 48.52,15.13 48.52,13.12 49.53,12.11 J8.7
N$18
  Top 0.203: U4.2 40.15,19.63 39.68,19.63 39.28,19.23 39.28,17.31 42.17,14.42 43.5,14.42 45.05,15.97 47.1,15.97 48.14,14.94 48.14,10.44 49,9.57 J8.8
N$19
  Bottom 0.254: J6.6 8.75,42.43 CY8CKIT059-TARGET.37
N$20
  Bottom 0.254: J6.1 8.75,55.13 CY8CKIT059-TARGET.32
N$21
  Bottom 0.254: J6.2 8.75,52.59 CY8CKIT059-TARGET.33
N$22
  Bottom 0.254: J6.3 8.75,50.05 CY8CKIT059-TARGET.34
N$23
  Bottom 0.254: CY8CKIT059-TARGET.35 4.23,47.5 J6.4
N$24
  Bottom 0.254: J6.5 8.75,44.97 CY8CKIT059-TARGET.36
N$25
  Top 0.254: D1.C 16.09,5.99 24.23,5.99 27.96,2.26 R1.P$1
N$26
  Top 0.254: D1.A 11.96,6.86 CY8CKIT059-TARGET.51
PHOTO_OUT
  Top 0.254: R11.2 36.24,29.79 R10.1
  Bottom 0.254: CY8CKIT059-TARGET.44 6.83,22.7 6.83,3.89 9.67,1.04 35.69,1.04 45.38,10.73 45.38,20.89 36.41,29.86 R10.1
TEMP_OUT
  Top 0.254: U2.2 6.8,63.68 6.8,29.14 CY8CKIT059-TARGET.43

### Text on the board
tPlace: SWITCH | 12V | 5V | MUX INPUT
bPlace: P05 | P04 | P03 | P02 | P01 | P00